# EAGLE design ADC board 2 (EAGLE 8.2.1)
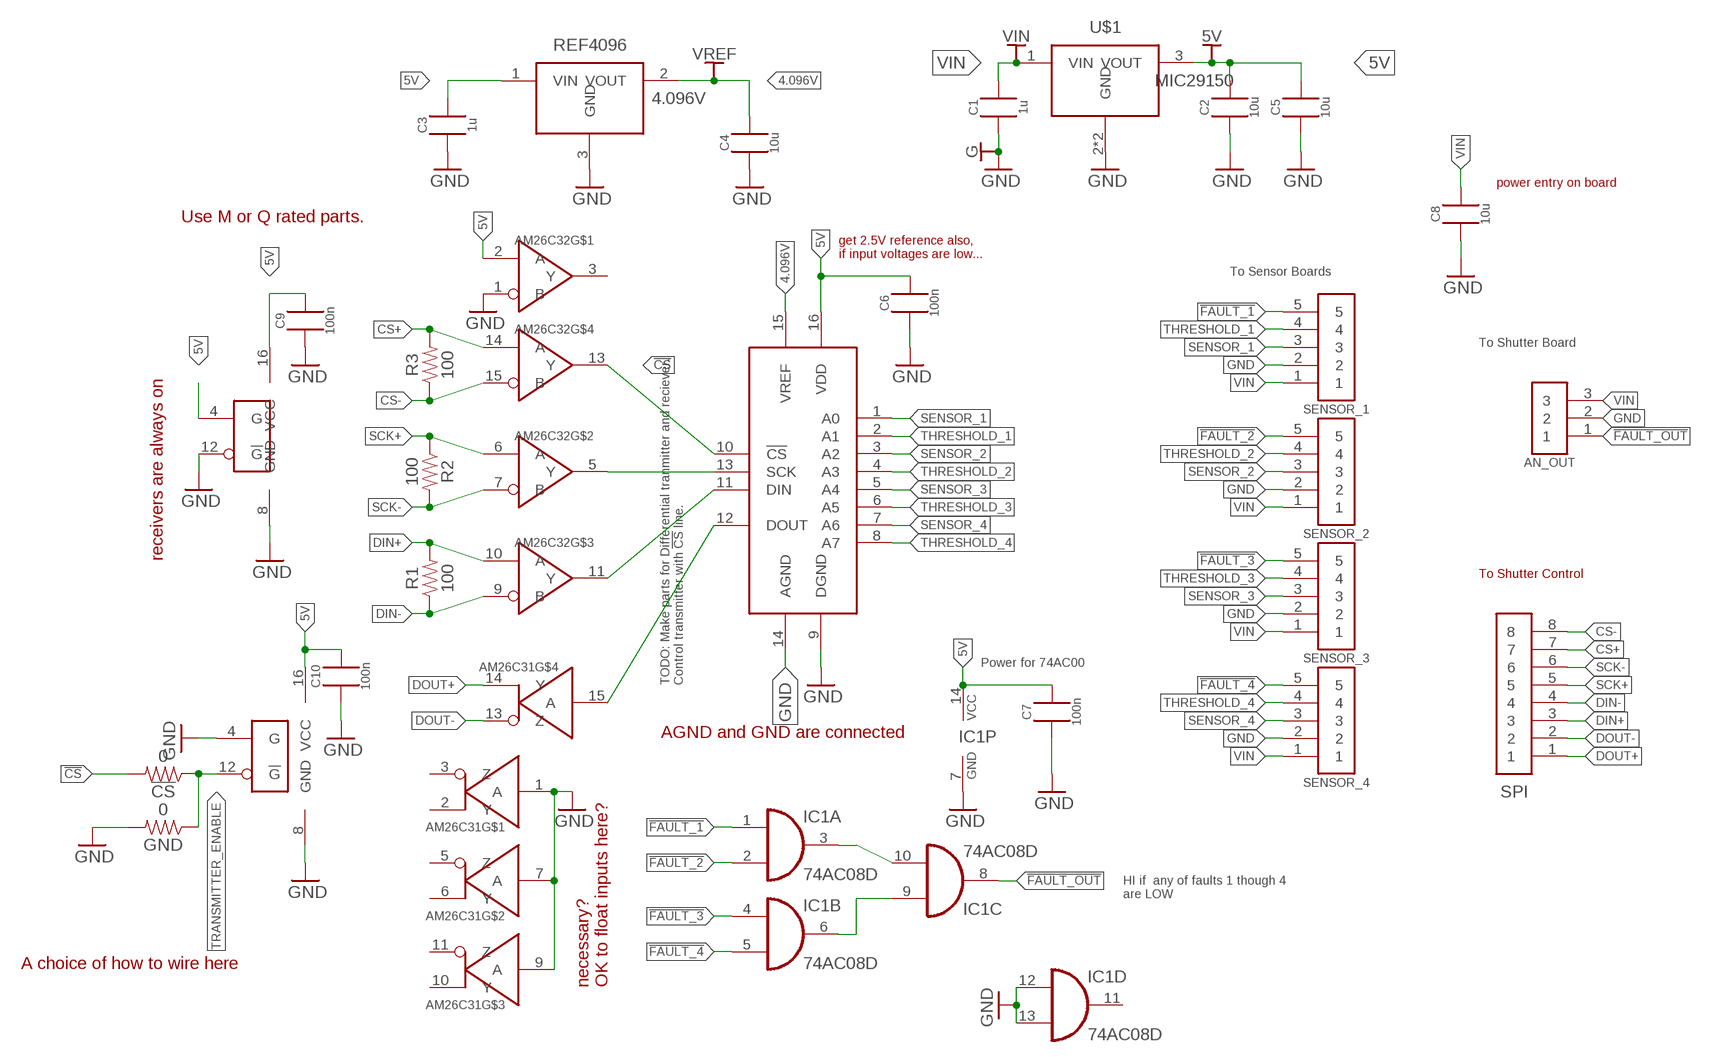
[diagram p0: schematic, sheet 1]

## Parts
5V  TEST_POINT5015  [5015]
!CS!  0  RESISTOR1206  [1206]
AM26C31  AM26C31  [SOIC_16_NARROW]
AM26C32  AM26C32  [SOIC_16_NARROW]
AN_OUT  MO3  [OSTVN03]
C1  1u  CAP805B  [0805_B]
C2  10u  CAP1206A  [1206_A]
C3  1u  CAP805B  [0805_B]
C4  10u  CAP1206A  [1206_A]
C5  10u  CAP1206A  [1206_A]
C6  100n  CAP805B  [0805_B]
C7  100n  CAP805B  [0805_B]
C8  10u  CAP1206A  [1206_A]
C9  100n  CAP805B  [0805_B]
C10  100n  CAP805B  [0805_B]
G  TEST_POINT5015  [5015]
GND  0  RESISTOR1206  [1206]
IC1  74AC08D  [SO14]
MCP3008  MCP3008MCP3008  [SOIC-16-NARROW]
R1  100  RESISTOR1206  [1206]
R2  100  RESISTOR1206  [1206]
R3  100  RESISTOR1206  [1206]
REF4096  4.096V  MCP1541  [SOT23A(CB)]
SENSOR_1  M05OSTVN05  [OSTVN05]
SENSOR_2  M05OSTVN05  [OSTVN05]
SENSOR_3  M05OSTVN05  [OSTVN05]
SENSOR_4  M05OSTVN05  [OSTVN05]
SPI  M08  [OSTVN08]
U$1  MIC29150  [TO263-3]
VIN  TEST_POINT5015  [5015]
VREF  TEST_POINT5015  [5015]

## Nets
4.096V: C4.2 MCP3008.15(VREF) REF4096.2(VOUT) VREF.1
5V [power]: 5V.1 AM26C31.16(VCC) AM26C32.2(A) AM26C32.4(G) AM26C32.16(VCC) C2.2 C3.2 C5.2 C6.2 C7.2 C9.2 C10.2 IC1.14(P:VCC) MCP3008.16(VDD) REF4096.1(VIN) U$1.3(VOUT)
!CS!: !CS!.2 AM26C32.13(Y) MCP3008.10(!CS!)
!FAULT_1: IC1.1(A:I0) SENSOR_1.5
!FAULT_2: IC1.2(A:I1) SENSOR_2.5
!FAULT_3: IC1.4(B:I0) SENSOR_3.5
!FAULT_4: IC1.5(B:I1) SENSOR_4.5
!FAULT_OUT!: AN_OUT.1 IC1.8(C:O)
CS+: AM26C32.14(A) R3.2 SPI.7
CS-: AM26C32.15(B) R3.1 SPI.8
DIN: AM26C32.11(Y) MCP3008.11(DIN)
DIN+: AM26C32.10(A) R1.2 SPI.3
DIN-: AM26C32.9(B) R1.1 SPI.4
DOUT: AM26C31.15(A) MCP3008.12(DOUT)
DOUT+: AM26C31.14(Y) SPI.1
DOUT-: AM26C31.13(Z) SPI.2
GND [power]: AM26C31.1(A) AM26C31.4(G) AM26C31.7(A) AM26C31.8(GND) AM26C31.9(A) AM26C32.1(B) AM26C32.8(GND) AM26C32.12(!G!) AN_OUT.2 C1.1 C2.1 C3.1 C4.1 C5.1 C6.1 C7.1 C8.1 C9.1 C10.1 G.1 GND.2 IC1.7(P:GND) IC1.12(D:I0) IC1.13(D:I1) MCP3008.9(DGND) MCP3008.14(AGND) REF4096.3(GND) SENSOR_1.2 SENSOR_2.2 SENSOR_3.2 SENSOR_4.2 U$1.2(GND) U$1.P$3(GND)
N$1: IC1.3(A:O) IC1.10(C:I1)
N$34: IC1.6(B:O) IC1.9(C:I0)
SCK: AM26C32.5(Y) MCP3008.13(SCK)
SCK+: AM26C32.6(A) R2.1 SPI.5
SCK-: AM26C32.7(B) R2.2 SPI.6
SENSOR_1: MCP3008.1(A0) SENSOR_1.3
SENSOR_2: MCP3008.3(A2) SENSOR_2.3
SENSOR_3: MCP3008.5(A4) SENSOR_3.3
SENSOR_4: MCP3008.7(A6) SENSOR_4.3
THRESHOLD_1: MCP3008.2(A1) SENSOR_1.4
THRESHOLD_2: MCP3008.4(A3) SENSOR_2.4
THRESHOLD_3: MCP3008.6(A5) SENSOR_3.4
THRESHOLD_4: MCP3008.8(A7) SENSOR_4.4
TRANSMITTER_ENABLE: !CS!.1 AM26C31.12(!G!) GND.1
VIN [power]: AN_OUT.3 C1.2 C8.2 SENSOR_1.1 SENSOR_2.1 SENSOR_3.1 SENSOR_4.1 U$1.1(VIN) VIN.1
Unconnected: AM26C31.2(Y) AM26C31.3(Z) AM26C31.5(Z) AM26C31.6(Y) AM26C31.10(Y) AM26C31.11(Z) AM26C32.3(Y) IC1.11(D:O)

## Notes on the sheet
- power entry on board
- Use M or Q rated parts.
- get 2.5V reference also,
  if input voltages are low...
- To Sensor Boards
- To Shutter Board
- receivers are always on
- To Shutter Control
- Power for 74AC00
- TODO: Make parts for Differential tranmitter and reciever.
  Control transmitter with !CS! line.
- AGND and GND are connected
- HI if  any of faults 1 though 4
  are LOW
- A choice of how to wire here
- necessary?
  OK to float inputs here?

## Library data of the parts
5V G VIN VREF = Keystone:TEST_POINT
!CS! GND R1-R3 = Stackpole:RESISTOR
AM26C31 = TEXAS_INSTRUMENTS:AM26C31: Quadruple Differential Line Driver http://www.ti.com/lit/ds/symlink/am26c31.pdf
AM26C32 = TEXAS_INSTRUMENTS:AM26C32: AM26C32 Quadruple Differential Line Receiver http://www.ti.com/lit/ds/symlink/am26c32.pdf
AN_OUT = OST:MO3
C1-C10 = KEMET:CAP
IC1 = 74xx-eu:74*08: Quad 2-input AND gate
MCP3008 = MICROCHIP:MCP3008
REF4096 = MICROCHIP:MCP1541: 4.096V Voltage Reference http://ww1.microchip.com/downloads/en/DeviceDoc/21653C.pdf
SENSOR_1-SENSOR_4 = OST:M05: screw terminal 0.1inch pitch digikey #: ED10564 http://www.on-shore.com/wp-content/uploads/2015/09/ostvnxxa150.pdf
SPI = OST:M08
U$1 = MICROCHIP:MIC29150: Voltage Regulator http://ww1.microchip.com/downloads/en/DeviceDoc/mic39100.pdf

## Net classes
0 default: width 0.3 mm
1 power: width 0.6 mm

## Board
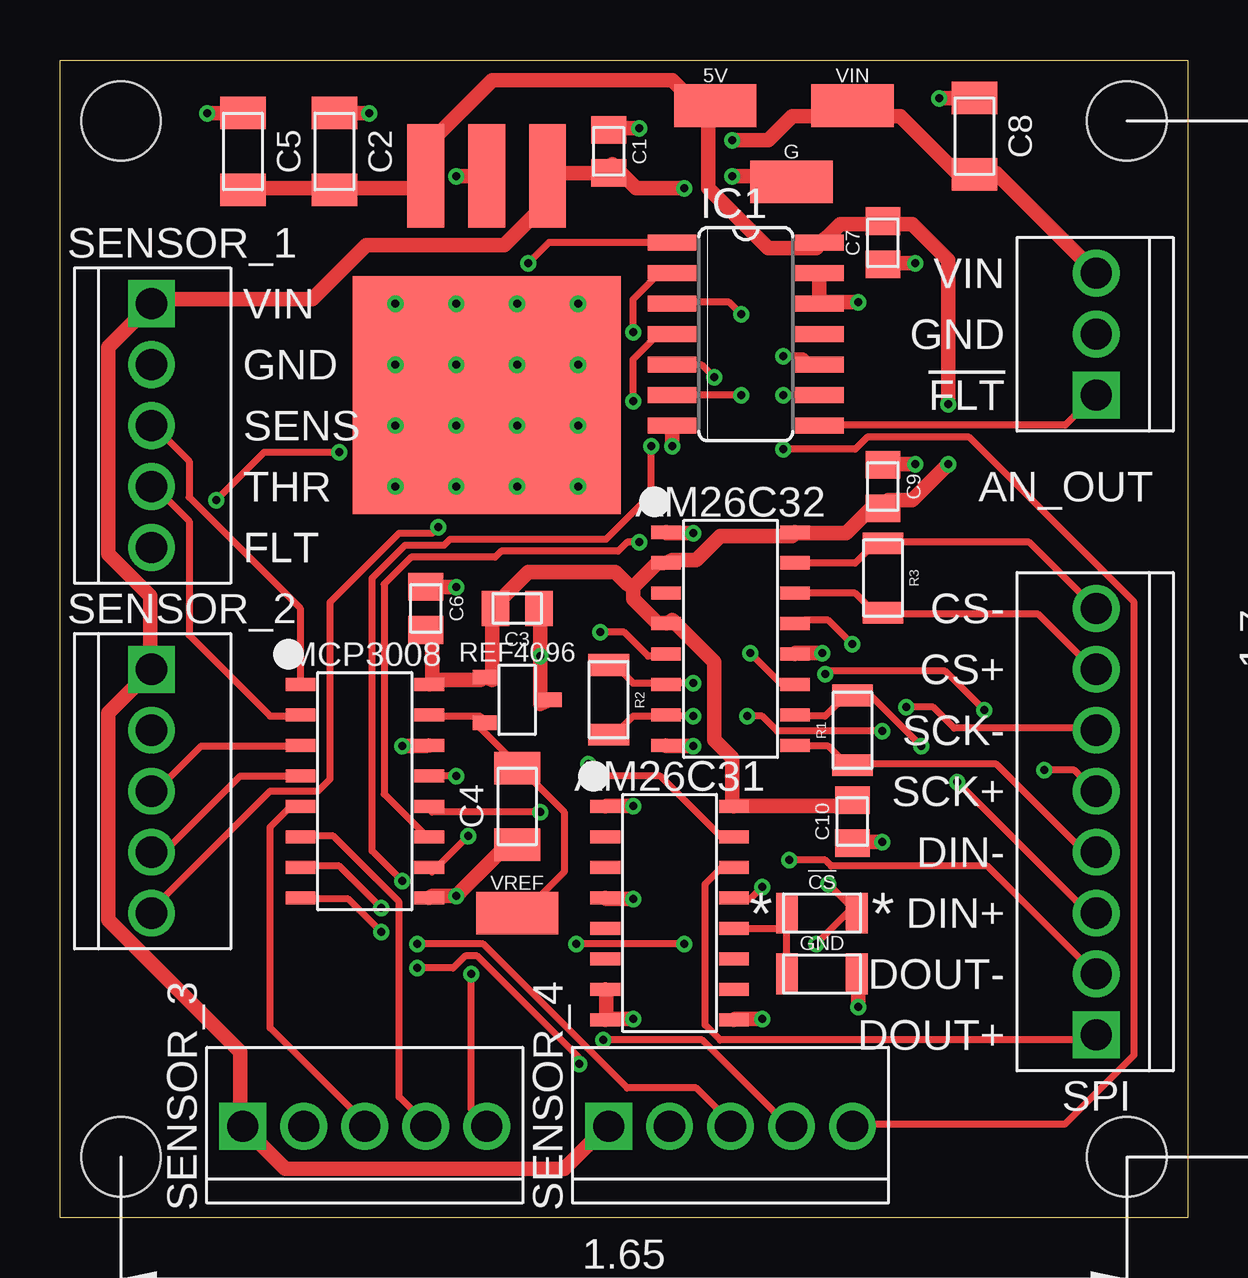
[diagram p1: board, top side]
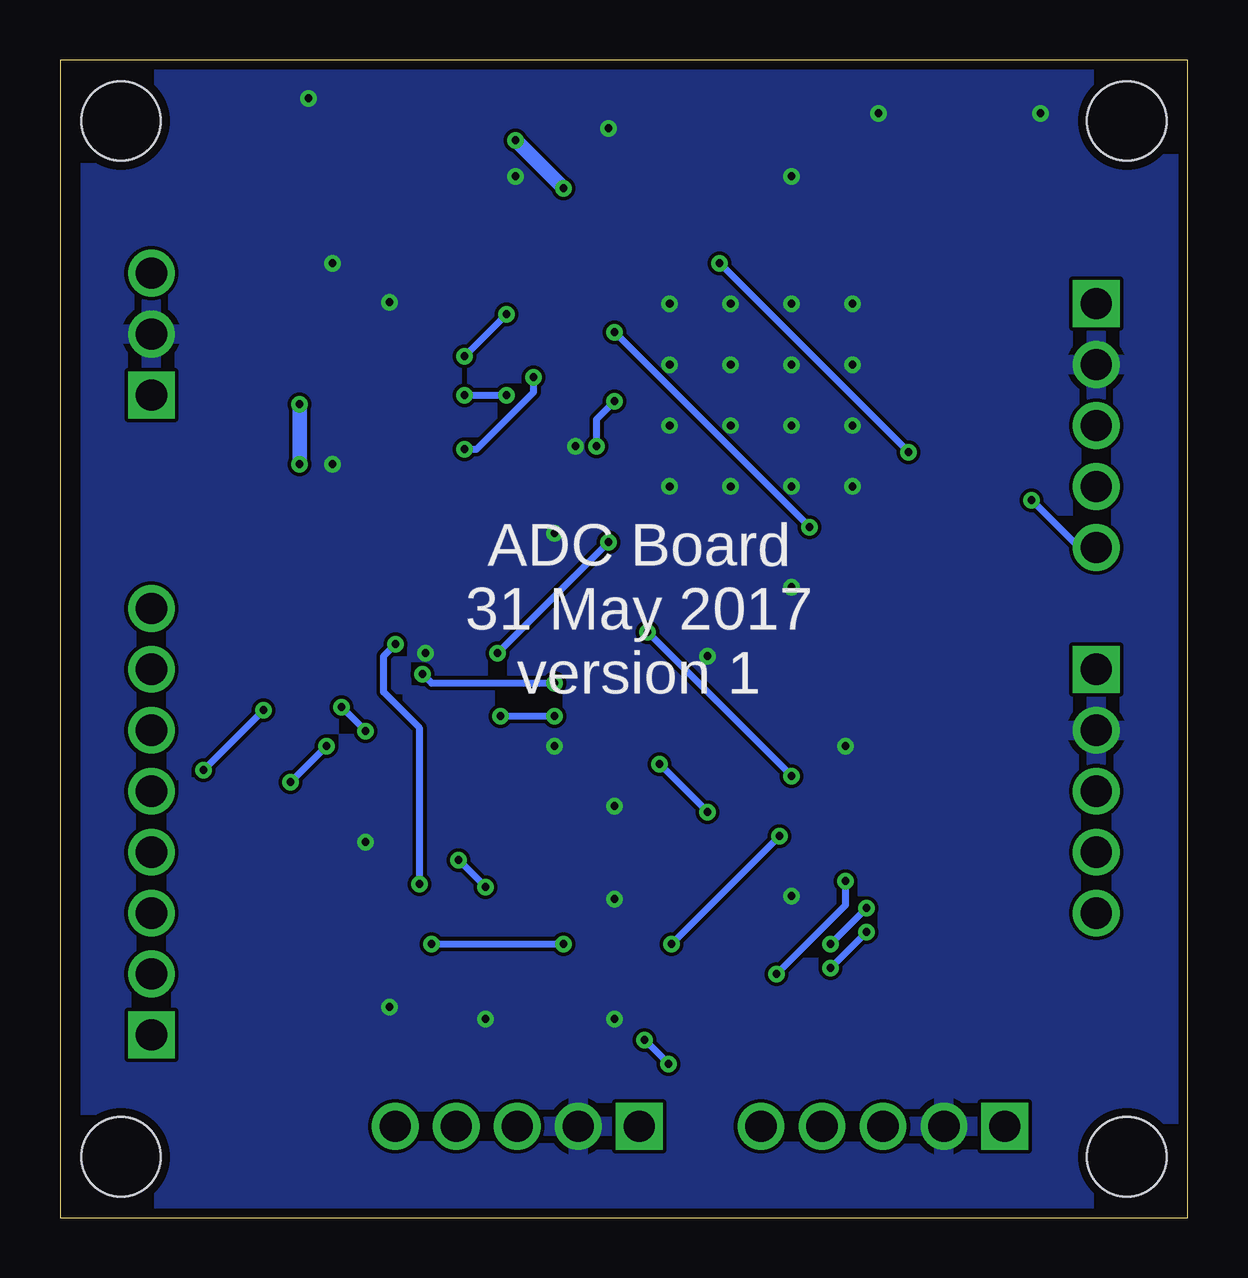
[diagram p2: board, bottom side, seen from below]

Size 46.99 x 48.26 mm. Coordinates in mm from the lower left corner, seen from the top.
Outline: 0,48.26 46.99,48.26 46.99,0 0,0 0,48.26
Copper layers (1*16): Top 0.0356mm / dielectric 1.5011mm / Bottom 0.0356mm
Design rules "oshpark-2layer": minimum track width 6mil, minimum drill 13mil, track to track 6mil, track to pad 6mil, pad to pad 6mil, via to via 6mil, smd to smd 6mil, copper to edge 15mil, drill to drill 6mil, minimum pad ring 7mil, minimum via ring 7mil, stop-mask expansion 2.5mil, vias tented up to drill 0mil, thermal gap 10mil

### Footprints (pad centres in the part's own frame; a part is rotated, then mirrored left to right if it is on the bottom)
5015 = smd 3.429 x 1.778: 1 0,0
1206 = smd 0.9 x 1.7: 1 -1.45,0; 2 1.45,0
SOIC_16_NARROW = smd 0.55 x 1.235: 1 -4.445,-2.683; 2 -3.175,-2.683; 3 -1.905,-2.683; 4 -0.635,-2.683; 5 0.635,-2.683; 6 1.905,-2.683; 7 3.175,-2.683; 8 4.445,-2.683; 9 4.445,2.683; 10 3.175,2.683; 11 1.905,2.683; 12 0.635,2.683; 13 -0.635,2.683; 14 -1.905,2.683; 15 -3.175,2.683; 16 -4.445,2.683
OSTVN03 = drill 1.3 square: 1 -2.54,0 | drill 1.3: 2 0,0; 3 2.54,0
0805_B = smd 1.15 x 1.45: 1 -0.9,0; 2 0.9,0
1206_A = smd 1.35 x 1.9: 1 -1.6,0; 2 1.6,0
SO14 = smd 0.66 x 2.032: 1 -3.81,-3.073; 2 -2.54,-3.073; 3 -1.27,-3.073; 4 0,-3.073; 5 1.27,-3.073; 6 2.54,-3.073; 7 3.81,-3.073; 8 3.81,3.073; 9 2.54,3.073; 10 1.27,3.073; 11 0,3.073; 12 -1.27,3.073; 13 -2.54,3.073; 14 -3.81,3.073
SOIC-16-NARROW = smd 0.55 x 1.235: 1 -4.445,-2.683; 2 -3.175,-2.683; 3 -1.905,-2.683; 4 -0.635,-2.683; 5 0.635,-2.683; 6 1.905,-2.683; 7 3.175,-2.683; 8 4.445,-2.683; 9 4.445,2.683; 10 3.175,2.683; 11 1.905,2.683; 12 0.635,2.683; 13 -0.635,2.683; 14 -1.905,2.683; 15 -3.175,2.683; 16 -4.445,2.683
SOT23A(CB) = smd 0.6 x 1: 1 -0.95,-1.35; 2 0.95,-1.35; 3 0,1.35
OSTVN05 = drill 1.3 square: 1 -5.08,0 | drill 1.3: 2 -2.54,0; 3 0,0; 4 2.54,0; 5 5.08,0
OSTVN08 = drill 1.3 square: 1 -8.89,0 | drill 1.3: 2 -6.35,0; 3 -3.81,0; 4 -1.27,0; 5 1.27,0; 6 3.81,0; 7 6.35,0; 8 8.89,0
TO263-3 = smd 1.524 x 4.318: 1 -2.54,-9.144; 2 0,-9.144; 3 2.54,-9.144 | smd 11.176 x 9.906: P$3 0,0
STAND-OFF = hole 3.302: 0,0

### Placement (x,y rotation side)
5V  27.3,46.35 0 top
!CS!  31.75,12.7 0 top
AM26C31  25.4,12.7 270 top
AM26C32  27.94,24.13 270 top
AN_OUT  43.18,36.83 90 top
C1  22.86,44.45 270 top
C2  11.43,44.45 270 top
C3  19.05,25.4 180 top
C4  19.05,17.14 90 top
C5  7.62,44.45 270 top
C6  15.24,25.4 270 top
C7  34.29,40.64 90 top
C8  38.1,45.08 270 top
C9  34.29,30.48 270 top
C10  33.02,16.51 90 top
G  30.48,43.18 0 top
GND  31.75,10.16 0 top
IC1  28.57,36.83 270 top
MCP3008  12.7,17.78 270 top
R1  33.02,20.32 90 top
R2  22.86,21.59 270 top
R3  34.29,26.67 270 top
REF4096  19.05,21.59 270 top
SENSOR_1  3.81,33.02 270 top
SENSOR_2  3.81,17.78 270 top
SENSOR_3  12.7,3.81 0 top
SENSOR_4  27.94,3.81 0 top
SPI  43.18,16.51 90 top
U$1  17.78,34.29 180 top
U$2  [STAND-OFF]  2.54,45.72 0 top
U$4  [STAND-OFF]  44.45,45.72 0 top
U$5  [STAND-OFF]  44.45,2.54 0 top
U$6  [STAND-OFF]  2.54,2.54 0 top
VIN  33.02,46.35 0 top
VREF  19.05,12.7 0 top

### Tracks (layer width: path | path; a pad name or v marks a point on that pad's centre or on a via)
4.096V
  Top 0.3: MCP3008.15 15.51,20.91 17.51,20.91 REF4096.2 17.51,20.41 19.01,18.91 C4.2 19.51,18.41 21.01,16.91 21.01,14.41 19.51,12.91 VREF.1
5V  (via drill 0.33)
  Top 0.6: C5.2 7.63,42.91 11.38,42.91 C2.2 11.63,42.91 15.01,42.91 15.26,43.16 15.26,43.41 U$1.3 15.51,43.91 15.51,44.91 18.01,47.41 25.51,47.41 27.01,45.91 | C10.2 32.76,17.41 32.51,17.16 28.13,17.16 AM26C31.16 28.01,17.41 28.01,19.16 27.26,19.91 27.26,23.16 25.51,24.91 AM26C32.4 25.13,24.79 24.88,24.79 23.88,25.79 23.88,26.29 | 23.88,26.29 24.88,27.29 25.13,27.29 AM26C32.2 25.51,27.41 26.51,27.41 27.51,28.41 30.51,28.41 AM26C32.16 30.63,28.54 32.76,28.54 33.76,29.54 34.26,29.54 C9.2 34.51,29.91 35.51,29.91 v37.01,31.41 | 23.88,26.29 23.63,26.41 23.13,26.91 19.51,26.91 18.26,25.66 C3.2 18.01,24.91 18.01,22.41 REF4096.1 17.51,22.41 15.51,22.41 | v37.01,33.91 37.01,39.91 35.51,41.41 34.51,41.41 C7.2 34.01,41.41 32.51,41.41 32.01,40.91 IC1.14 31.51,40.41 29.51,40.41 27.01,42.91 27.01,45.91 | 27.01,45.91 5V.1 | 15.51,22.41 15.51,24.41 C6.2 | 15.51,22.41 MCP3008.16
  Bottom 0.6: v37.01,33.91 v37.01,31.41
!CS!  (via drill 0.33)
  Top 0.3: v17.01,15.91 15.51,14.41 MCP3008.10 | v26.01,11.41 v21.51,11.41 | 33.01,12.91 v31.51,11.41 | v33.01,23.91 32.01,24.91 31.01,24.91 AM26C32.13 | 33.01,12.91 v32.01,13.91 | 33.01,12.91 !CS!.2
  Bottom 0.3: v21.51,11.41 v17.01,15.91 | v31.51,11.41 v26.01,11.41 | v33.01,23.91 33.51,23.41 33.51,21.91 32.01,20.41 v32.01,13.91
!FAULT_1  (via drill 0.33)
  Top 0.3: v19.51,39.78 20.38,40.66 25.38,40.66 IC1.1 | v11.63,31.91 8.51,31.91 v6.51,29.91
  Bottom 0.3: v11.63,31.91 v19.51,39.78 | v6.51,29.91 4.63,28.04 3.88,28.04 SENSOR_1.5
!FAULT_2  (via drill 0.33)
  Top 0.3: v23.88,36.91 23.88,38.28 25.01,39.41 25.38,39.41 IC1.2 | v15.76,28.79 15.51,28.54 14.13,28.54 11.26,25.66 11.26,18.29 10.76,17.79 8.76,17.79 3.76,12.79 SENSOR_2.5
  Bottom 0.3: v15.76,28.79 v23.88,36.91
!FAULT_3  (via drill 0.33)
  Top 0.3: v23.88,34.03 23.88,35.78 24.88,36.78 25.38,36.78 IC1.4 | v24.63,32.16 24.63,30.16 22.76,28.29 16.26,28.29 16.01,28.04 14.38,28.04 13.01,26.66 13.01,15.29 v14.26,14.04 | v17.13,10.16 17.13,4.54 17.76,3.91 SENSOR_3.5
  Bottom 0.3: v23.88,34.03 24.63,33.28 v24.63,32.16 | v14.26,14.04 14.26,13.04 v17.13,10.16
!FAULT_4  (via drill 0.33)
  Top 0.3: v27.26,35.03 26.76,35.53 25.51,35.53 IC1.5 | v30.13,32.03 33.13,32.03 33.63,32.53 37.88,32.53 44.76,25.66 44.76,6.79 41.88,3.91 33.13,3.91 SENSOR_4.5
  Bottom 0.3: v27.26,35.03 27.26,34.41 29.63,32.03 v30.13,32.03
!FAULT_OUT!
  Top 0.3: IC1.8 31.76,33.03 41.88,33.03 43.13,34.28 AN_OUT.1
CS+
  Top 0.3: AM26C32.14 33.13,26.04 34.01,25.16 34.26,25.16 R3.2 34.38,25.16 40.76,25.16 43.13,22.79 SPI.7
CS-
  Top 0.3: AM26C32.15 30.63,27.29 33.13,27.29 34.01,28.16 34.26,28.16 R3.1 34.38,28.16 40.38,28.16 43.13,25.41 SPI.8
DIN  (via drill 0.33)
  Top 0.3: v24.13,28.16 23.63,28.16 23.26,27.79 18.38,27.79 18.13,27.54 14.63,27.54 13.51,26.41 13.51,17.66 15.26,15.91 MCP3008.11 | v28.76,23.54 30.01,22.29 30.51,22.29 AM26C32.11
  Bottom 0.3: v28.76,23.54 v24.13,28.16
DIN+  (via drill 0.33)
  Top 0.3: AM26C32.10 30.63,20.91 31.88,20.91 32.76,21.79 33.01,21.79 R1.2 33.13,21.79 33.76,21.79 v35.88,19.66 | v37.38,18.16 42.76,12.79 43.13,12.79 SPI.3
  Bottom 0.3: v37.38,18.16 v35.88,19.66
DIN-
  Top 0.3: AM26C32.9 30.63,19.66 32.01,19.66 32.76,18.91 33.01,18.91 R1.1 33.13,18.91 39.01,18.91 42.63,15.29 43.13,15.29 SPI.4
DOUT  (via drill 0.33)
  Top 0.3: v20.01,16.91 15.51,16.91 MCP3008.12 | v22.01,18.91 22.51,18.41 25.01,18.41 27.51,15.91 28.01,15.91 AM26C31.15
  Bottom 0.3: v22.01,18.91 v20.01,16.91
DOUT+
  Top 0.3: AM26C31.14 28.01,14.66 27.63,14.66 26.88,13.91 26.88,8.04 27.51,7.41 43.01,7.41 43.13,7.54 SPI.1
DOUT-  (via drill 0.33)
  Top 0.3: v29.26,13.79 28.76,13.29 28.13,13.29 AM26C31.13 | v30.38,14.91 31.88,14.91 32.13,14.66 38.63,14.66 43.13,10.16 SPI.2
  Bottom 0.3: v30.38,14.91 v29.26,13.79
GND  (via drill 0.33)
  Top 0.6: IC1.13 31.63,39.28 31.63,38.16 IC1.12 31.88,38.16 v33.26,38.16 | v23.88,8.29 22.76,8.29 | 22.76,8.29 AM26C31.8 | 22.76,8.29 22.76,9.41 AM26C31.7 | v14.26,19.66 15.26,19.66 MCP3008.14 | v29.26,8.29 28.13,8.29 AM26C31.9 | v23.88,13.29 22.76,13.29 AM26C31.4 | v23.88,17.16 22.76,17.16 AM26C31.1 | v26.38,19.66 25.26,19.66 AM26C32.8 | v26.38,28.54 25.26,28.54 AM26C32.1 | v31.76,23.54 30.63,23.54 AM26C32.12 | v16.51,26.29 15.26,26.29 C6.1 | v34.26,15.66 33.13,15.66 C10.1 | v35.63,31.41 34.38,31.41 C9.1 | v24.13,45.41 22.88,45.41 C1.1 | v35.63,39.78 34.38,39.78 C7.1 | v33.26,8.79 33.26,10.16 GND.2 | v6.13,46.03 7.51,46.03 C5.1 | v12.88,46.03 11.51,46.03 C2.1 | v36.63,46.66 38.01,46.66 C8.1 | v25.51,32.16 25.51,32.91 IC1.7 | v16.51,43.41 17.76,43.41 U$1.2 | U$1.P$3 17.88,34.41 19.01,35.53 v19.05,35.56 | v28.01,43.41 30.01,43.41 G.1 | REF4096.3 20.01,21.41 v20.01,23.41 20.01,24.91 C3.1 | MCP3008.9 15.51,13.41 v16.51,13.41 19.01,15.91 C4.1
  other vias: 13.97,35.56 13.97,33.02 13.97,38.1 16.51,38.1 13.97,30.48 19.05,38.1 21.59,38.1 21.59,35.56 21.59,33.02 21.59,30.48 19.05,30.48 16.51,30.48 16.51,33.02 16.51,35.56 19.05,33.02
  pour Bottom: -5.08,50.8 45.72,50.8 45.72,-2.54 -5.08,-2.54
N$1  (via drill 0.33)
  Top 0.3: v28.38,37.66 27.88,38.16 25.51,38.16 IC1.3 | v30.13,35.91 31.01,35.91 31.38,35.53 31.63,35.53 IC1.10
  Bottom 0.3: v30.13,35.91 v28.38,37.66
N$34  (via drill 0.33)
  Top 0.3: v28.38,34.28 IC1.6 | v30.13,34.28 31.63,34.28 IC1.9
  Bottom 0.3: v30.13,34.28 v28.38,34.28
SCK  (via drill 0.33)
  Top 0.3: v16.51,18.41 15.51,18.41 MCP3008.13 | v22.51,24.41 23.51,24.41 24.51,23.41 25.01,23.41 AM26C32.5
  Bottom 0.3: v22.51,24.41 v16.51,18.41
SCK+  (via drill 0.33)
  Top 0.3: R2.1 22.88,23.04 23.13,23.04 23.88,22.29 25.13,22.29 AM26C32.6 25.38,22.29 v26.38,22.29 | v31.88,22.66 32.01,22.79 36.88,22.79 v38.51,21.16 | v41.01,18.66 42.26,18.66 43.13,17.79 SPI.5
  Bottom 0.3: v26.38,22.29 31.51,22.29 v31.88,22.66 | v41.01,18.66 v38.51,21.16
SCK-  (via drill 0.33)
  Top 0.3: R2.2 22.88,20.16 23.13,20.16 23.88,20.91 25.13,20.91 AM26C32.7 25.38,20.91 v26.38,20.91 | v28.63,20.91 29.26,20.91 29.88,20.29 v34.26,20.29 | v35.26,21.29 36.38,21.29 37.26,20.41 43.13,20.41 SPI.6
  Bottom 0.3: v28.63,20.91 v26.38,20.91 | v35.26,21.29 v34.26,20.29
SENSOR_1
  Top 0.3: MCP3008.1 10.01,22.29 10.01,25.41 5.38,30.04 5.38,31.54 3.88,33.03 SENSOR_1.3
SENSOR_2
  Top 0.3: MCP3008.3 10.01,19.66 5.88,19.66 3.88,17.66 SENSOR_2.3
SENSOR_3
  Top 0.3: MCP3008.5 10.01,17.16 9.63,17.16 8.76,16.29 8.76,7.91 12.76,3.91 SENSOR_3.3
SENSOR_4  (via drill 0.33)
  Top 0.3: v13.38,12.91 11.63,14.66 10.13,14.66 MCP3008.7 | v14.88,11.41 17.63,11.41 23.63,5.41 26.51,5.41 28.01,3.91 SENSOR_4.3
  Bottom 0.3: v14.88,11.41 v13.38,12.91
THRESHOLD_1
  Top 0.3: MCP3008.2 10.01,20.91 8.76,20.91 5.38,24.29 5.38,29.04 3.88,30.54 SENSOR_1.4
THRESHOLD_2
  Top 0.3: MCP3008.4 7.51,18.41 4.38,15.29 3.88,15.29 SENSOR_2.4
THRESHOLD_3
  Top 0.3: MCP3008.6 10.13,15.91 11.38,15.91 14.13,13.16 14.13,5.04 15.26,3.91 SENSOR_3.4
THRESHOLD_4  (via drill 0.33)
  Top 0.3: v13.38,11.91 12.01,13.29 10.13,13.29 MCP3008.8 | v14.88,10.41 16.38,10.41 16.88,10.91 17.38,10.91 21.63,6.66 v21.63,6.41 | v22.63,7.41 26.76,7.41 30.38,3.79 SENSOR_4.4
  Bottom 0.3: v14.88,10.41 v13.38,11.91 | v22.63,7.41 v21.63,6.41
TRANSMITTER_ENABLE
  Top 0.3: AM26C31.12 28.13,12.04 29.88,12.04 30.26,12.41 30.26,12.66 !CS!.1 30.26,12.29 30.26,10.16 GND.1
VIN  (via drill 0.33)
  Top 0.6: SENSOR_4.1 22.76,3.79 21.01,2.04 9.38,2.04 7.63,3.79 SENSOR_3.1 7.51,4.04 7.51,6.91 2.01,12.41 2.01,21.04 3.63,22.66 SENSOR_2.1 3.76,22.91 3.76,25.91 2.01,27.66 2.01,36.28 3.76,38.03 SENSOR_1.1 4.01,38.28 10.51,38.28 12.76,40.53 18.51,40.53 20.26,42.28 20.26,43.16 U$1.1 20.38,43.53 22.76,43.53 C1.2 23.01,43.91 24.01,42.91 v26.01,42.91 | AN_OUT.3 43.13,39.41 39.01,43.53 38.13,43.53 C8.2 38.01,43.41 37.51,43.41 35.01,45.91 33.51,45.91 VIN.1 33.01,45.91 30.51,45.91 29.51,44.91 v28.01,44.91
  Bottom 0.6: v26.01,42.91 v28.01,44.91

### Text on the board
tPlace: VIN | VIN | GND | GND | !FLT! | SENS | THR | FLT | CS- | CS+ | SCK- | SCK+ | DIN- | * | * | DIN+ | DOUT- | DOUT+
bPlace: ADC Board / 31 May 2017 / version 1